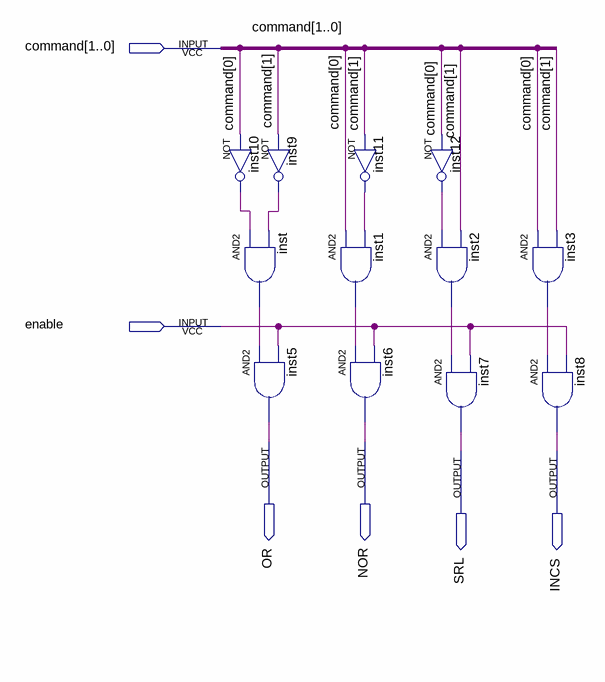
[diagram p0: schematic sheet]
// Quartus schematic ALU_COMMAND_DECODER.bdf as structural Verilog: 12 symbols, 6 pins
module ALU_COMMAND_DECODER (
  input  [1:0] command,
  input  enable,
  output OR,
  output NOR,
  output SRL,
  output INCS
);

  wire inst1_out, inst2_out, inst3_out, inst9_out, inst10_out, inst11_out, inst12_out, inst_out;

  not inst9 (inst9_out, command[1]);
  not inst10 (inst10_out, command[0]);
  and inst (inst_out, inst10_out, inst9_out);
  and inst5 (OR, inst_out, enable);
  not inst11 (inst11_out, command[1]);
  and inst1 (inst1_out, command[0], inst11_out);
  and inst6 (NOR, inst1_out, enable);
  not inst12 (inst12_out, command[0]);
  and inst2 (inst2_out, inst12_out, command[1]);
  and inst7 (SRL, inst2_out, enable);
  and inst3 (inst3_out, command[0], command[1]);
  and inst8 (INCS, inst3_out, enable);
endmodule
